# Altium project Grabber.PrjPCB (part 1 of 2)
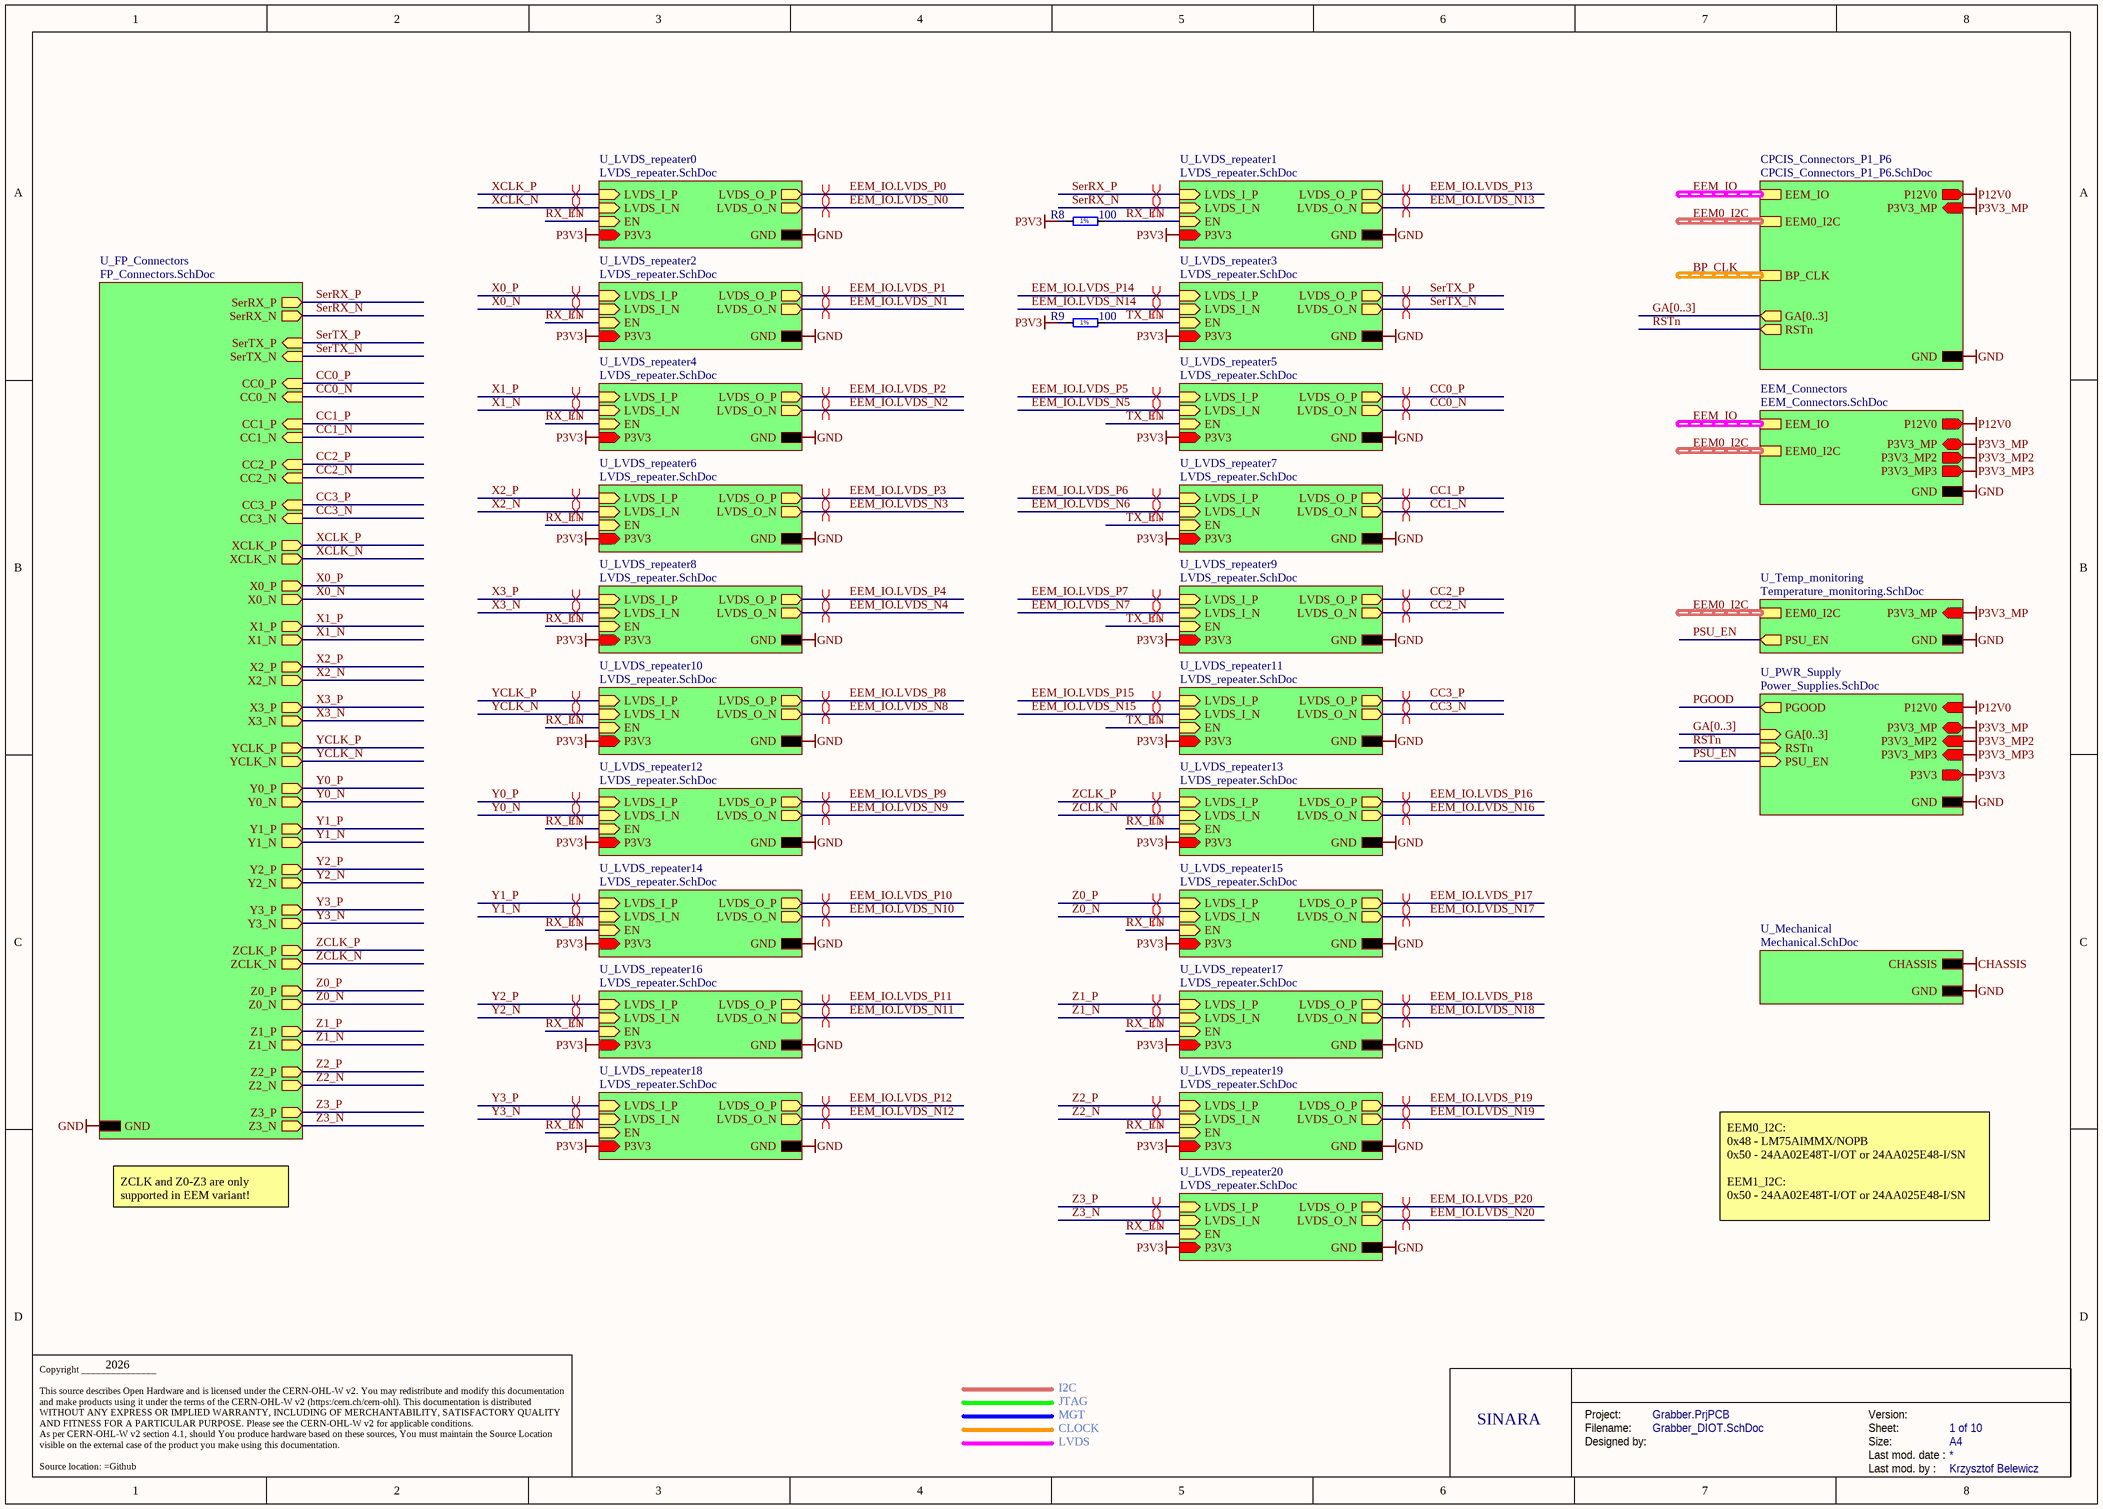
[diagram p0: Grabber_DIOT.SchDoc]
P_version: 2.0.0; P_github_link: https://github.com/sinara-hw/Grabber; P_author3: Krzysztof Belewicz; P_author2: Maciej Przybysz, Marta Fąfara; P_author1: Grzegorz Kasprowicz
9 sheets, 220 parts. Net scope: strictly hierarchical (ports join the sheet entries above them; power ports are local).
Board file: Grabber_DIOT.PCBDOC
Sheets:
  Grabber_DIOT.SchDoc
    U_PWR_Supply = Power_Supplies.SchDoc
    CPCIS_Connectors_P1_P6 = CPCIS_Connectors_P1_P6.SchDoc
      U_DIOT_signal_routing = DIOT_signal_routing.SchDoc
    EEM_Connectors = EEM_Connectors.SchDoc
    U_Temp_monitoring = Temperature_monitoring.SchDoc
    U_Mechanical = Mechanical.SchDoc
    U_FP_Connectors = FP_Connectors.SchDoc
    U_LVDS_repeater0 = LVDS_repeater.SchDoc
    U_LVDS_repeater2 = LVDS_repeater.SchDoc
    U_LVDS_repeater4 = LVDS_repeater.SchDoc
    U_LVDS_repeater6 = LVDS_repeater.SchDoc
    U_LVDS_repeater8 = LVDS_repeater.SchDoc
    U_LVDS_repeater10 = LVDS_repeater.SchDoc
    U_LVDS_repeater12 = LVDS_repeater.SchDoc
    U_LVDS_repeater14 = LVDS_repeater.SchDoc
    U_LVDS_repeater16 = LVDS_repeater.SchDoc
    U_LVDS_repeater18 = LVDS_repeater.SchDoc
    U_LVDS_repeater1 = LVDS_repeater.SchDoc
    U_LVDS_repeater3 = LVDS_repeater.SchDoc
    U_LVDS_repeater5 = LVDS_repeater.SchDoc
    U_LVDS_repeater7 = LVDS_repeater.SchDoc
    U_LVDS_repeater9 = LVDS_repeater.SchDoc
    U_LVDS_repeater11 = LVDS_repeater.SchDoc
    U_LVDS_repeater13 = LVDS_repeater.SchDoc
    U_LVDS_repeater15 = LVDS_repeater.SchDoc
    U_LVDS_repeater17 = LVDS_repeater.SchDoc
    U_LVDS_repeater19 = LVDS_repeater.SchDoc
    U_LVDS_repeater20 = LVDS_repeater.SchDoc

## Sheet Grabber_DIOT.SchDoc: =DocumentName
size A3; DocumentNumber: 1; Revision: 0; SheetNumber: 1; SheetTotal: 10; Version: 2.0.0; Author 1: Grzegorz Kasprowicz; Author 2: Maciej Przybysz, Marta Fąfara; Author 3: Krzysztof Belewicz; Github: https://github.com/sinara-hw/Grabber; Last modified by: Krzysztof Belewicz

### Parts
R8  100  [RESC1005X40N]
R9  100  [RESC1005X40N]

### Sub-sheets
CPCIS_Connectors_P1_P6 = CPCIS_Connectors_P1_P6.SchDoc: P12V0 (out), P3V3_MP (in), EEM_IO (harness EEM_LVDS), EEM0_I2C (harness I2C), BP_CLK (harness CLK_DIFF), GA[0..3] (out), GND, RSTn (out)
EEM_Connectors = EEM_Connectors.SchDoc: P3V3_MP (bidir), P12V0 (out), EEM_IO (harness EEM_LVDS), EEM0_I2C (harness I2C), GND, P3V3_MP2 (out), P3V3_MP3 (out)
U_FP_Connectors = FP_Connectors.SchDoc: SerRX_P (out), SerRX_N (out), Z3_P (out), Z3_N (out), Z2_P (out), Z2_N (out), Z1_P (out), Z1_N (out), Z0_P (out), Z0_N (out), ZCLK_P (out), ZCLK_N (out), Y3_P (out), Y3_N (out), Y2_P (out), Y2_N (out), Y1_P (out), Y1_N (out), Y0_P (out), Y0_N (out), YCLK_P (out), YCLK_N (out), X3_P (out), X3_N (out), X2_P (out), X2_N (out), X1_P (out), X1_N (out), X0_P (out), X0_N (out), XCLK_P (out), XCLK_N (out), CC3_P (in), CC3_N (in), CC2_P (in), CC2_N (in), CC1_P (in), CC1_N (in), CC0_P (in), CC0_N (in), SerTX_P (in), SerTX_N (in), GND
U_LVDS_repeater0 = LVDS_repeater.SchDoc: LVDS_I_P (in), LVDS_I_N (in), LVDS_O_P (out), LVDS_O_N (out), EN (in), GND, P3V3 (in)
U_LVDS_repeater1 = LVDS_repeater.SchDoc: LVDS_I_P (in), LVDS_I_N (in), LVDS_O_P (out), LVDS_O_N (out), EN (in), GND, P3V3 (in)
U_LVDS_repeater2 = LVDS_repeater.SchDoc: LVDS_I_P (in), LVDS_I_N (in), LVDS_O_P (out), LVDS_O_N (out), EN (in), GND, P3V3 (in)
U_LVDS_repeater3 = LVDS_repeater.SchDoc: LVDS_I_P (in), LVDS_I_N (in), LVDS_O_P (out), LVDS_O_N (out), EN (in), GND, P3V3 (in)
U_LVDS_repeater4 = LVDS_repeater.SchDoc: LVDS_I_P (in), LVDS_I_N (in), LVDS_O_P (out), LVDS_O_N (out), EN (in), GND, P3V3 (in)
U_LVDS_repeater5 = LVDS_repeater.SchDoc: LVDS_I_P (in), LVDS_I_N (in), LVDS_O_P (out), LVDS_O_N (out), EN (in), GND, P3V3 (in)
U_LVDS_repeater6 = LVDS_repeater.SchDoc: LVDS_I_P (in), LVDS_I_N (in), LVDS_O_P (out), LVDS_O_N (out), EN (in), GND, P3V3 (in)
U_LVDS_repeater7 = LVDS_repeater.SchDoc: LVDS_I_P (in), LVDS_I_N (in), LVDS_O_P (out), LVDS_O_N (out), EN (in), GND, P3V3 (in)
U_LVDS_repeater8 = LVDS_repeater.SchDoc: LVDS_I_P (in), LVDS_I_N (in), LVDS_O_P (out), LVDS_O_N (out), EN (in), GND, P3V3 (in)
U_LVDS_repeater9 = LVDS_repeater.SchDoc: LVDS_I_P (in), LVDS_I_N (in), LVDS_O_P (out), LVDS_O_N (out), EN (in), GND, P3V3 (in)
U_LVDS_repeater10 = LVDS_repeater.SchDoc: LVDS_I_P (in), LVDS_I_N (in), LVDS_O_P (out), LVDS_O_N (out), EN (in), GND, P3V3 (in)
U_LVDS_repeater11 = LVDS_repeater.SchDoc: LVDS_I_P (in), LVDS_I_N (in), LVDS_O_P (out), LVDS_O_N (out), EN (in), GND, P3V3 (in)
U_LVDS_repeater12 = LVDS_repeater.SchDoc: LVDS_I_P (in), LVDS_I_N (in), LVDS_O_P (out), LVDS_O_N (out), EN (in), GND, P3V3 (in)
U_LVDS_repeater13 = LVDS_repeater.SchDoc: LVDS_I_P (in), LVDS_I_N (in), LVDS_O_P (out), LVDS_O_N (out), EN (in), GND, P3V3 (in)
U_LVDS_repeater14 = LVDS_repeater.SchDoc: LVDS_I_P (in), LVDS_I_N (in), LVDS_O_P (out), LVDS_O_N (out), EN (in), GND, P3V3 (in)
U_LVDS_repeater15 = LVDS_repeater.SchDoc: LVDS_I_P (in), LVDS_I_N (in), LVDS_O_P (out), LVDS_O_N (out), EN (in), GND, P3V3 (in)
U_LVDS_repeater16 = LVDS_repeater.SchDoc: LVDS_I_P (in), LVDS_I_N (in), LVDS_O_P (out), LVDS_O_N (out), EN (in), GND, P3V3 (in)
U_LVDS_repeater17 = LVDS_repeater.SchDoc: LVDS_I_P (in), LVDS_I_N (in), LVDS_O_P (out), LVDS_O_N (out), EN (in), GND, P3V3 (in)
U_LVDS_repeater18 = LVDS_repeater.SchDoc: LVDS_I_P (in), LVDS_I_N (in), LVDS_O_P (out), LVDS_O_N (out), EN (in), GND, P3V3 (in)
U_LVDS_repeater19 = LVDS_repeater.SchDoc: LVDS_I_P (in), LVDS_I_N (in), LVDS_O_P (out), LVDS_O_N (out), EN (in), GND, P3V3 (in)
U_LVDS_repeater20 = LVDS_repeater.SchDoc: LVDS_I_P (in), LVDS_I_N (in), LVDS_O_P (out), LVDS_O_N (out), EN (in), GND, P3V3 (in)
U_Mechanical = Mechanical.SchDoc: CHASSIS, GND
U_PWR_Supply = Power_Supplies.SchDoc: GND, P12V0 (in), P3V3 (out), P3V3_MP (bidir), PGOOD (out), GA[0..3] (in), RSTn (in), PSU_EN (in), P3V3_MP2 (in), P3V3_MP3 (in)
U_Temp_monitoring = Temperature_monitoring.SchDoc: GND, P3V3_MP (in), EEM0_I2C (harness I2C), PSU_EN (out)

### Nets
GND: sheet U_PWR_Supply/GND, sheet CPCIS_Connectors_P1_P6/GND, sheet EEM_Connectors/GND, sheet U_Temp_monitoring/GND, sheet U_Mechanical/GND, sheet U_FP_Connectors/GND, sheet U_LVDS_repeater0/GND, sheet U_LVDS_repeater2/GND, sheet U_LVDS_repeater4/GND, sheet U_LVDS_repeater6/GND, sheet U_LVDS_repeater8/GND, sheet U_LVDS_repeater10/GND, sheet U_LVDS_repeater12/GND, sheet U_LVDS_repeater14/GND, sheet U_LVDS_repeater16/GND, sheet U_LVDS_repeater18/GND, sheet U_LVDS_repeater1/GND, sheet U_LVDS_repeater3/GND, sheet U_LVDS_repeater5/GND, sheet U_LVDS_repeater7/GND, sheet U_LVDS_repeater9/GND, sheet U_LVDS_repeater11/GND, sheet U_LVDS_repeater13/GND, sheet U_LVDS_repeater15/GND, sheet U_LVDS_repeater17/GND, sheet U_LVDS_repeater19/GND, sheet U_LVDS_repeater20/GND
P3V3: R8.1 R9.1 ; sheet U_PWR_Supply/P3V3, sheet U_LVDS_repeater0/P3V3, sheet U_LVDS_repeater2/P3V3, sheet U_LVDS_repeater4/P3V3, sheet U_LVDS_repeater6/P3V3, sheet U_LVDS_repeater8/P3V3, sheet U_LVDS_repeater10/P3V3, sheet U_LVDS_repeater12/P3V3, sheet U_LVDS_repeater14/P3V3, sheet U_LVDS_repeater16/P3V3, sheet U_LVDS_repeater18/P3V3, sheet U_LVDS_repeater1/P3V3, sheet U_LVDS_repeater3/P3V3, sheet U_LVDS_repeater5/P3V3, sheet U_LVDS_repeater7/P3V3, sheet U_LVDS_repeater9/P3V3, sheet U_LVDS_repeater11/P3V3, sheet U_LVDS_repeater13/P3V3, sheet U_LVDS_repeater15/P3V3, sheet U_LVDS_repeater17/P3V3, sheet U_LVDS_repeater19/P3V3, sheet U_LVDS_repeater20/P3V3
P3V3_MP: sheet U_PWR_Supply/P3V3_MP, sheet CPCIS_Connectors_P1_P6/P3V3_MP, sheet EEM_Connectors/P3V3_MP, sheet U_Temp_monitoring/P3V3_MP
P3V3_MP2: sheet U_PWR_Supply/P3V3_MP2, sheet EEM_Connectors/P3V3_MP2
P3V3_MP3: sheet U_PWR_Supply/P3V3_MP3, sheet EEM_Connectors/P3V3_MP3
P12V0: sheet U_PWR_Supply/P12V0, sheet CPCIS_Connectors_P1_P6/P12V0, sheet EEM_Connectors/P12V0
CC0_N: sheet U_FP_Connectors/CC0_N, sheet U_LVDS_repeater5/LVDS_O_N
CC0_P: sheet U_FP_Connectors/CC0_P, sheet U_LVDS_repeater5/LVDS_O_P
CC1_N: sheet U_FP_Connectors/CC1_N, sheet U_LVDS_repeater7/LVDS_O_N
CC1_P: sheet U_FP_Connectors/CC1_P, sheet U_LVDS_repeater7/LVDS_O_P
CC2_N: sheet U_FP_Connectors/CC2_N, sheet U_LVDS_repeater9/LVDS_O_N
CC2_P: sheet U_FP_Connectors/CC2_P, sheet U_LVDS_repeater9/LVDS_O_P
CC3_N: sheet U_FP_Connectors/CC3_N, sheet U_LVDS_repeater11/LVDS_O_N
CC3_P: sheet U_FP_Connectors/CC3_P, sheet U_LVDS_repeater11/LVDS_O_P
PSU_EN: sheet U_PWR_Supply/PSU_EN, sheet U_Temp_monitoring/PSU_EN
RSTn: sheet U_PWR_Supply/RSTn, sheet CPCIS_Connectors_P1_P6/RSTn
RX_EN: R8.2 ; sheet U_LVDS_repeater0/EN, sheet U_LVDS_repeater2/EN, sheet U_LVDS_repeater4/EN, sheet U_LVDS_repeater6/EN, sheet U_LVDS_repeater8/EN, sheet U_LVDS_repeater10/EN, sheet U_LVDS_repeater12/EN, sheet U_LVDS_repeater14/EN, sheet U_LVDS_repeater16/EN, sheet U_LVDS_repeater18/EN, sheet U_LVDS_repeater1/EN, sheet U_LVDS_repeater13/EN, sheet U_LVDS_repeater15/EN, sheet U_LVDS_repeater17/EN, sheet U_LVDS_repeater19/EN, sheet U_LVDS_repeater20/EN
SerRX_N: sheet U_FP_Connectors/SerRX_N, sheet U_LVDS_repeater1/LVDS_I_N
SerRX_P: sheet U_FP_Connectors/SerRX_P, sheet U_LVDS_repeater1/LVDS_I_P
SerTX_N: sheet U_FP_Connectors/SerTX_N, sheet U_LVDS_repeater3/LVDS_O_N
SerTX_P: sheet U_FP_Connectors/SerTX_P, sheet U_LVDS_repeater3/LVDS_O_P
TX_EN: R9.2 ; sheet U_LVDS_repeater3/EN, sheet U_LVDS_repeater5/EN, sheet U_LVDS_repeater7/EN, sheet U_LVDS_repeater9/EN, sheet U_LVDS_repeater11/EN
X0_N: sheet U_FP_Connectors/X0_N, sheet U_LVDS_repeater2/LVDS_I_N
X0_P: sheet U_FP_Connectors/X0_P, sheet U_LVDS_repeater2/LVDS_I_P
X1_N: sheet U_FP_Connectors/X1_N, sheet U_LVDS_repeater4/LVDS_I_N
X1_P: sheet U_FP_Connectors/X1_P, sheet U_LVDS_repeater4/LVDS_I_P
X2_N: sheet U_FP_Connectors/X2_N, sheet U_LVDS_repeater6/LVDS_I_N
X2_P: sheet U_FP_Connectors/X2_P, sheet U_LVDS_repeater6/LVDS_I_P
X3_N: sheet U_FP_Connectors/X3_N, sheet U_LVDS_repeater8/LVDS_I_N
X3_P: sheet U_FP_Connectors/X3_P, sheet U_LVDS_repeater8/LVDS_I_P
XCLK_N: sheet U_FP_Connectors/XCLK_N, sheet U_LVDS_repeater0/LVDS_I_N
XCLK_P: sheet U_FP_Connectors/XCLK_P, sheet U_LVDS_repeater0/LVDS_I_P
Y0_N: sheet U_FP_Connectors/Y0_N, sheet U_LVDS_repeater12/LVDS_I_N
Y0_P: sheet U_FP_Connectors/Y0_P, sheet U_LVDS_repeater12/LVDS_I_P
Y1_N: sheet U_FP_Connectors/Y1_N, sheet U_LVDS_repeater14/LVDS_I_N
Y1_P: sheet U_FP_Connectors/Y1_P, sheet U_LVDS_repeater14/LVDS_I_P
Y2_N: sheet U_FP_Connectors/Y2_N, sheet U_LVDS_repeater16/LVDS_I_N
Y2_P: sheet U_FP_Connectors/Y2_P, sheet U_LVDS_repeater16/LVDS_I_P
Y3_N: sheet U_FP_Connectors/Y3_N, sheet U_LVDS_repeater18/LVDS_I_N
Y3_P: sheet U_FP_Connectors/Y3_P, sheet U_LVDS_repeater18/LVDS_I_P
YCLK_N: sheet U_FP_Connectors/YCLK_N, sheet U_LVDS_repeater10/LVDS_I_N
YCLK_P: sheet U_FP_Connectors/YCLK_P, sheet U_LVDS_repeater10/LVDS_I_P
Z0_N: sheet U_FP_Connectors/Z0_N, sheet U_LVDS_repeater15/LVDS_I_N
Z0_P: sheet U_FP_Connectors/Z0_P, sheet U_LVDS_repeater15/LVDS_I_P
Z1_N: sheet U_FP_Connectors/Z1_N, sheet U_LVDS_repeater17/LVDS_I_N
Z1_P: sheet U_FP_Connectors/Z1_P, sheet U_LVDS_repeater17/LVDS_I_P
Z2_N: sheet U_FP_Connectors/Z2_N, sheet U_LVDS_repeater19/LVDS_I_N
Z2_P: sheet U_FP_Connectors/Z2_P, sheet U_LVDS_repeater19/LVDS_I_P
Z3_N: sheet U_FP_Connectors/Z3_N, sheet U_LVDS_repeater20/LVDS_I_N
Z3_P: sheet U_FP_Connectors/Z3_P, sheet U_LVDS_repeater20/LVDS_I_P
ZCLK_N: sheet U_FP_Connectors/ZCLK_N, sheet U_LVDS_repeater13/LVDS_I_N
ZCLK_P: sheet U_FP_Connectors/ZCLK_P, sheet U_LVDS_repeater13/LVDS_I_P

### Buses and harness runs
bus GA[0..3] = sheet CPCIS_Connectors_P1_P6/GA[0..3]
bus GA[0..3] = sheet U_PWR_Supply/GA[0..3]
harness BP_CLK = sheet CPCIS_Connectors_P1_P6/BP_CLK
harness EEM0_I2C = sheet CPCIS_Connectors_P1_P6/EEM0_I2C
harness EEM0_I2C = sheet EEM_Connectors/EEM0_I2C
harness EEM0_I2C = sheet U_Temp_monitoring/EEM0_I2C
harness EEM_IO = sheet CPCIS_Connectors_P1_P6/EEM_IO
harness EEM_IO = sheet EEM_Connectors/EEM_IO

### Layout directives
differential pair: CC0_N, CC0_P, CC1_N, CC1_P, CC2_N, CC2_P, CC3_N, CC3_P, EEM_IO.LVDS_N0, EEM_IO.LVDS_N1, EEM_IO.LVDS_N2, EEM_IO.LVDS_N3, EEM_IO.LVDS_N4, EEM_IO.LVDS_N5, EEM_IO.LVDS_N6, EEM_IO.LVDS_N7, EEM_IO.LVDS_N8, EEM_IO.LVDS_N9, EEM_IO.LVDS_N10, EEM_IO.LVDS_N11, EEM_IO.LVDS_N12, EEM_IO.LVDS_N13, EEM_IO.LVDS_N14, EEM_IO.LVDS_N15, EEM_IO.LVDS_N16, EEM_IO.LVDS_N17, EEM_IO.LVDS_N18, EEM_IO.LVDS_N19, EEM_IO.LVDS_N20, EEM_IO.LVDS_P0, EEM_IO.LVDS_P1, EEM_IO.LVDS_P2, EEM_IO.LVDS_P3, EEM_IO.LVDS_P4, EEM_IO.LVDS_P5, EEM_IO.LVDS_P6, EEM_IO.LVDS_P7, EEM_IO.LVDS_P8, EEM_IO.LVDS_P9, EEM_IO.LVDS_P10, EEM_IO.LVDS_P11, EEM_IO.LVDS_P12, EEM_IO.LVDS_P13, EEM_IO.LVDS_P14, EEM_IO.LVDS_P15, EEM_IO.LVDS_P16, EEM_IO.LVDS_P17, EEM_IO.LVDS_P18, EEM_IO.LVDS_P19, EEM_IO.LVDS_P20, SerRX_N, SerRX_P, SerTX_N, SerTX_P, X0_N, X0_P, X1_N, X1_P, X2_N, X2_P, X3_N, X3_P, XCLK_N, XCLK_P, Y0_N, Y0_P, Y1_N, Y1_P, Y2_N, Y2_P, Y3_N, Y3_P, YCLK_N, YCLK_P, Z0_N, Z0_P, Z1_N, Z1_P, Z2_N, Z2_P, Z3_N, Z3_P, ZCLK_N, ZCLK_P

### Notes on the sheet
- ZCLK and Z0-Z3 are only supported in EEM variant!
- EEM0_I2C:
  0x48 - LM75AIMMX/NOPB
  0x50 - 24AA02E48T-I/OT or 24AA025E48-I/SN
  EEM1_I2C:
  0x50 - 24AA02E48T-I/OT or 24AA025E48-I/SN
- 2026
- I2C
- JTAG
- MGT
- CLOCK
- LVDS
- SINARA
- Project:
- Designed by:
- Filename:
- Size:
- Version:
- Last mod. date :
- Sheet:
- A4
- Copyright _______________
  This source describes Open Hardware and is licensed under the CERN-OHL-W v2. You may redistribute and modify this documentation and make products using it under the terms of the CERN-OHL-W v2 (https:/cern.ch/cern-ohl). This documentation is distributed WITHOUT ANY EXPRESS OR IMPLIED WARRANTY, INCLUDING OF MERCHANTABILITY, SATISFACTORY QUALITY AND FITNESS FOR A PARTICULAR PURPOSE. Please see the CERN-OHL-W v2 for applicable conditions.
  As per CERN-OHL-W v2 section 4.1, should You produce hardware based on these sources, You must maintain the Source Location visible on the external case of the product you make using this documentation.
  Source location: =Github
- Last mod. by :
- (in symbol R0402_100R_1%_0.1W_100PPM) 1%

### Library data of the parts
R8 R9 = R0402_100R_1%_0.1W_100PPM: Resistor - 1%; Part Description: General Purpose Thick Film Chip Resistor; Manufacturer: GENERIC; Manufacturer Part Number: R0402_100R_1%_0.1W_100PPM_50V; Manufacturer1 Part Number: ERJ2RKF1000X; Power: 0.1W; TC: ±100ppm/°C; Voltage: 50V; Part Number: R0402_100R_1%_0.1W_100PPM; Component Kind: Standard; Component Type: Standard; Pin Count: 2; Value: 100; Status: Not recommended; Tolerance: ±1%; Case: 0402; Mounted: Yes; Sense: No; Socket: No; SMD: Yes; Manufacturer1 Example: PANASONIC; Manufacturer1 ComponentHeight: 0.4mm; HelpURL: \\cern.ch\dfs\Applications\Altium\Datasheets\R0402_PANASONIC_ERJ2RK.pdf; Author: CERN DEM JLC; CreateDate: 12.12.2013; LatestRevisionDate: 03.03.2015

## Sheet Power_Supplies.SchDoc: =DocumentName
size A4; DocumentNumber: 1; Revision: 0; SheetNumber: 3; SheetTotal: 10; Version: 2.0.0; Author 1: Grzegorz Kasprowicz; Author 2: Maciej Przybysz, Marta Fąfara; Author 3: Krzysztof Belewicz; Github: https://github.com/sinara-hw/Grabber; Last modified by: Krzysztof Belewicz
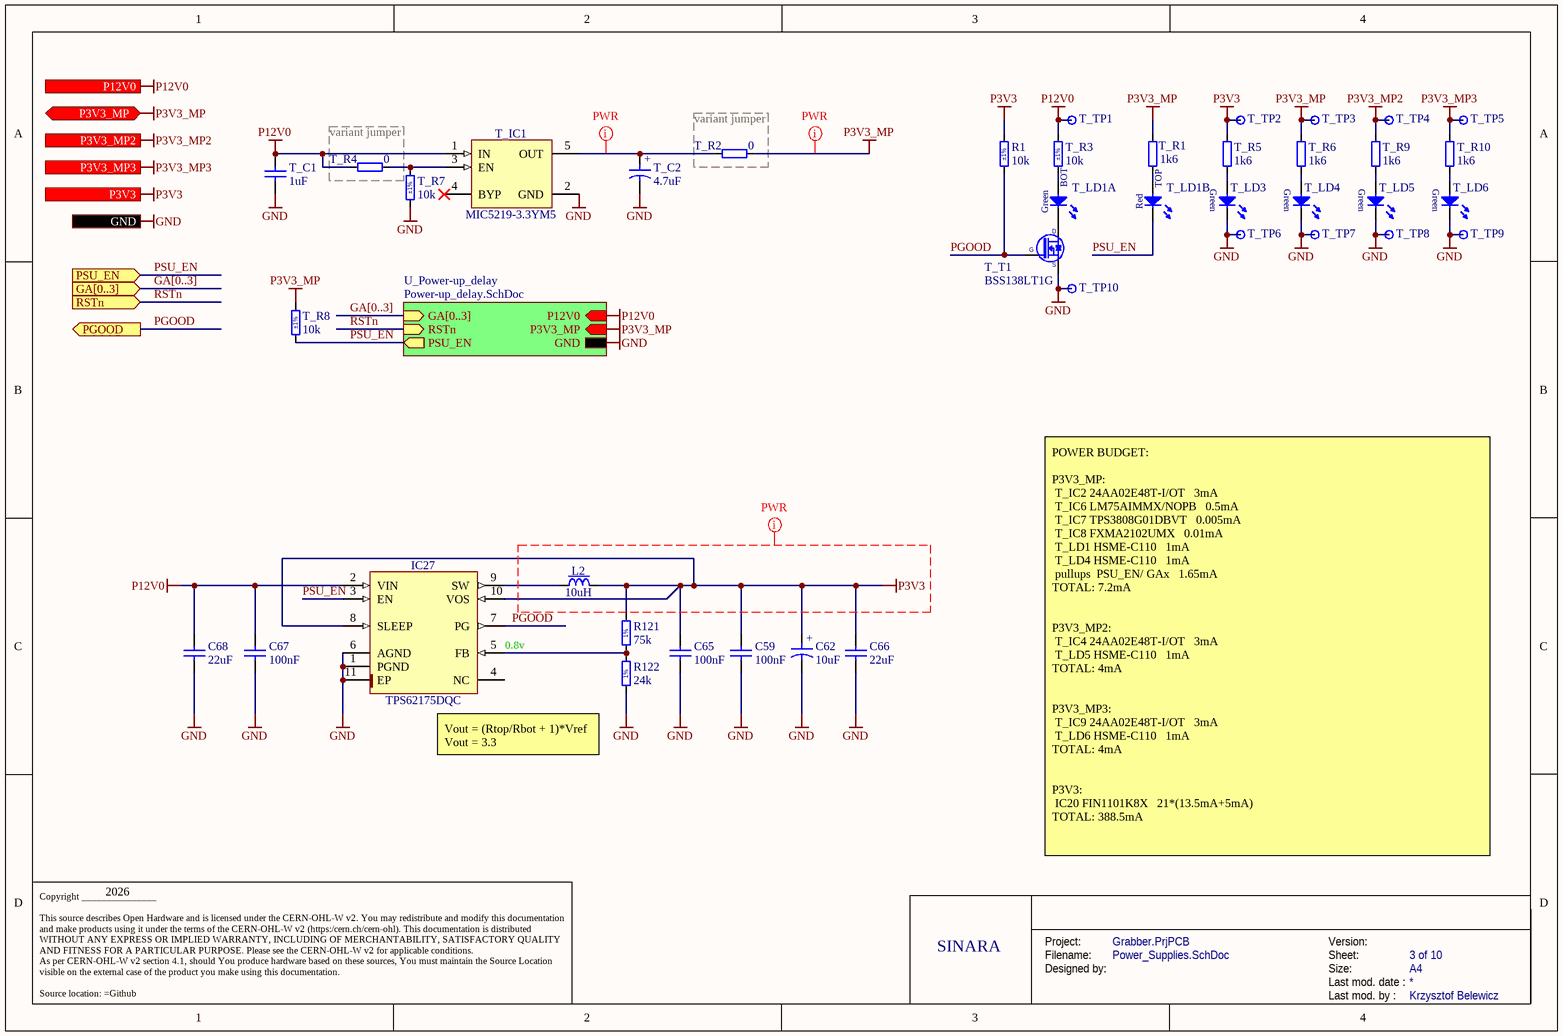
[diagram p1: Power_Supplies.SchDoc]

### Parts
C59  100nF  [CAPC1005X55N]
C62  10uF  [CAPAE430X540N]
C65  100nF  [CAPC1005X55N]
C66  22uF  [CAPC2012X135N]
C67  100nF  [CAPC1005X55N]
C68  22uF  [CAPC2012X135N]
IC27  TPS62175DQC  [SON50P200X300X80-11N-R94X250]
L2  10uH  [IND_MURATA-PS_8400]
R1  10k  Tolerance: ±1%  [RESC1005X40N]
R121  75k  [RESC1005X40N]
R122  24k  [RESC1005X40N]
T_C1  1uF  [CAPC1608X87N]
T_C2  4.7uF  [CAPMP3216X180N]
T_IC1  MIC5219-3.3YM5  [SOT95P280X145-5N]
T_LD1  Red/Green  [LED_DIALIGHT_571-0112F]  (value not drawn)  (parts A,B of 2)
T_LD3  Green  [LED_KINGBRIGHT_KPH-1608CGCK]  (value not drawn)
T_LD4  Green  [LED_KINGBRIGHT_KPH-1608CGCK]  (value not drawn)
T_LD5  Green  [LED_KINGBRIGHT_KPH-1608CGCK]  (value not drawn)
T_LD6  Green  [LED_KINGBRIGHT_KPH-1608CGCK]  (value not drawn)
T_R1  1k6  [RESC1005X40N]
T_R2  0  [RESC1005X40N]
T_R3  10k  Tolerance: ±1%  [RESC1005X40N]
T_R4  0  [RESC1005X40N]
T_R5  1k6  [RESC1005X40N]
T_R6  1k6  [RESC1005X40N]
T_R7  10k  Tolerance: ±1%  [RESC1005X40N]
T_R8  10k  Tolerance: ±1%  [RESC1005X40N]
T_R9  1k6  [RESC1005X40N]
T_R10  1k6  [RESC1005X40N]
T_T1  BSS138LT1G  [SOT95P240X110-3N]
T_TP1  Test Point  [TPS127]  (value not drawn)  (no BOM)
T_TP2  Test Point  [TPS127]  (value not drawn)  (no BOM)
T_TP3  Test Point  [TPS127]  (value not drawn)  (no BOM)
T_TP4  Test Point  [TPS127]  (value not drawn)  (no BOM)
T_TP5  Test Point  [TPS127]  (value not drawn)  (no BOM)
T_TP6  Test Point  [TPS127]  (value not drawn)  (no BOM)
T_TP7  Test Point  [TPS127]  (value not drawn)  (no BOM)
T_TP8  Test Point  [TPS127]  (value not drawn)  (no BOM)
T_TP9  Test Point  [TPS127]  (value not drawn)  (no BOM)
T_TP10  Test Point  [TPS127]  (value not drawn)  (no BOM)

### Blocks framed on the sheet
variant jumper: T_R4
variant jumper: T_R2

### Sub-sheets
U_Power-up_delay = Power-up_delay.SchDoc (file not in this document): GA[0..3] (in), RSTn (in), GND, PSU_EN (out), P3V3_MP (in), P12V0 (in)

### Ports
GA[0..3] (in), GND, P3V3 (out), P3V3_MP2 (in), P3V3_MP3 (in), P3V3_MP (bidir), P12V0 (in), PGOOD (out), PSU_EN (in), RSTn (in)

### Nets
GND: C59.1 C62.2 C65.1 C66.1 C67.1 C68.1 IC27.1(PGND) IC27.6(AGND) IC27.11(EP) R122.1 T_C1.1 T_C2.2 T_IC1.2(GND) T_LD3.1(C) T_LD4.1(C) T_LD5.1(C) T_LD6.1(C) T_R7.1 T_T1.2(S) T_TP6.1 T_TP7.1 T_TP8.1 T_TP9.1 T_TP10.1 ; port GND, sheet U_Power-up_delay/GND
P3V3: C59.2 C62.1 C65.2 C66.2 IC27.8(SLEEP) IC27.10(VOS) L2.2 R1.2 R121.2 T_R5.2 T_TP2.1 ; port P3V3
P3V3_MP: T_R1.2 T_R2.2 T_R6.2 T_R8.2 T_TP3.1 ; port P3V3_MP, sheet U_Power-up_delay/P3V3_MP
P3V3_MP2: T_R9.2 T_TP4.1 ; port P3V3_MP2
P3V3_MP3: T_R10.2 T_TP5.1 ; port P3V3_MP3
P12V0: C67.2 C68.2 IC27.2(VIN) T_C1.2 T_IC1.1(IN) T_R3.2 T_R4.1 T_TP1.1 ; port P12V0, sheet U_Power-up_delay/P12V0
PGOOD: IC27.7(PG) R1.1 T_T1.1(G) ; port PGOOD
PSU_EN: IC27.3(EN) T_LD1.3(C) T_R8.1 ; port PSU_EN, sheet U_Power-up_delay/PSU_EN
RSTn: port RSTn, sheet U_Power-up_delay/RSTn
NetIC27_5: IC27.5(FB) R121.1 R122.2
NetIC27_9: IC27.9(SW) L2.1
NetT_C2_1: T_C2.1 T_IC1.5(OUT) T_R2.1
NetT_IC1_3: T_IC1.3(EN) T_R4.2 T_R7.2
NetT_LD1_1: T_LD1.1(C) T_T1.3(D)
NetT_LD1_2: T_LD1.2(A) T_R3.1
NetT_LD1_4: T_LD1.4(A) T_R1.1
NetT_LD3_2: T_LD3.2(A) T_R5.1
NetT_LD4_2: T_LD4.2(A) T_R6.1
NetT_LD5_2: T_LD5.2(A) T_R9.1
NetT_LD6_2: T_LD6.2(A) T_R10.1

Not connected (* = marked no-connect by the designer): IC27 4(NC); T_IC1 4(BYP)*

### Buses and harness runs
bus GA[0..3] = port GA[0..3]
bus GA[0..3] = sheet U_Power-up_delay/GA[0..3]

### Layout directives
net class PWR: NetT_C2_1, P3V3, P3V3_MP

### Notes on the sheet
- (near IC27) 0.8v
- Vout = (Rtop/Rbot + 1)*Vref
  Vout = 3.3
- POWER BUDGET:
  P3V3_MP:
  T_IC2	24AA02E48T-I/OT			3mA
  T_IC6	LM75AIMMX/NOPB			0.5mA
  T_IC7	TPS3808G01DBVT			0.005mA
  T_IC8	FXMA2102UMX			0.01mA
  T_LD1	HSME-C110			1mA
  T_LD4	HSME-C110			1mA
  pullups 	PSU_EN/ GAx			1.65mA
  TOTAL: 7.2mA
  P3V3_MP2:
  T_IC4	24AA02E48T-I/OT			3mA
  T_LD5	HSME-C110			1mA
  TOTAL: 4mA
  P3V3_MP3:
  T_IC9	24AA02E48T-I/OT			3mA
  T_LD6	HSME-C110			1mA
  TOTAL: 4mA
  P3V3:
  IC20	FIN1101K8X			21*(13.5mA+5mA)
  TOTAL: 388.5mA
- 2026
- SINARA
- Project:
- Designed by:
- Filename:
- Size:
- Version:
- Last mod. date :
- Sheet:
- A4
- Copyright _______________
  This source describes Open Hardware and is licensed under the CERN-OHL-W v2. You may redistribute and modify this documentation and make products using it under the terms of the CERN-OHL-W v2 (https:/cern.ch/cern-ohl). This documentation is distributed WITHOUT ANY EXPRESS OR IMPLIED WARRANTY, INCLUDING OF MERCHANTABILITY, SATISFACTORY QUALITY AND FITNESS FOR A PARTICULAR PURPOSE. Please see the CERN-OHL-W v2 for applicable conditions.
  As per CERN-OHL-W v2 section 4.1, should You produce hardware based on these sources, You must maintain the Source Location visible on the external case of the product you make using this documentation.
  Source location: =Github
- Last mod. by :
- (in symbol CAE430-540_10UF_16V_20%) +
- (in symbol CTE3216-18_4.7UF_10V_10%_AVX_TPSA475K010T1400) +
- (in symbol LED_DIALIGHT_571-0112F, part A) BOT; Green
- (in symbol LED_DIALIGHT_571-0112F, part B) TOP; Red
- (in symbol R0402_24K_1%_0.0625W_100PPM) 1%
- (in symbol R0402_75K_1%_0.0625W_100PPM) 1%

### Library data of the parts
C59 C65 C67 = CC0402_100NF_50V_10%_X7R: Non-polarised capacitor; Part Description: SMD Multilayer Chip Ceramic Capacitor; Manufacturer: GENERIC; Manufacturer1 Part Number: GRM155R71H104KE14D; Voltage: 50V; TC: X7R; Tolerance: ±10%; Part Number: CC0402_100NF_50V_10%_X7R; Component Kind: Standard; Component Type: Standard; Pin Count: 2; Value: 100nF; Status: None; Manufacturer Part Number: CC0402_100NF_50V_10%_X7R; Case: 0402; Mounted: Yes; Socket: No; SMD: Yes; Sense: No; HelpURL: \\cern.ch\dfs\Applications\Altium\Datasheets\CC0402_MURATA_GRM155R71H104KE14D.pdf; Author: CERN DEM MR; CreateDate: 30.06.2017; LatestRevisionDate: 30.06.2017; Manufacturer1 Example: MURATA; Manufacturer1 ComponentHeight: 0.55mm
C62 = CAE430-540_10UF_16V_20%: Polarised capacitor; Part Description: Aluminum Electrolytic SMT Capacitor; Manufacturer: PANASONIC; Manufacturer Part Number: EEEFK1C100AR; Voltage: 16V; Tolerance: ±20%; Part Number: CAE430-540_10UF_16V_20%; Component Kind: Standard; Component Type: Standard; Pin Count: 2; Value: 10uF; Status: Not Recommended; Case: B; Mounted: Yes; Socket: No; SMD: Yes; Sense: No; ComponentHeight: 5.8mm; HelpURL: \\cern.ch\dfs\Applications\Altium\Datasheets\CAE_PANASONIC_FK.pdf; Author: CERN DEM JLC; CreateDate: 03.12.2007; LatestRevisionDate: 05.11.2014
C66 C68 = CC0805_22UF_16V_10%_X5R: Non-polarised capacitor; Part Description: SMD Multilayer Chip Ceramic Capacitor; Manufacturer: GENERIC; Manufacturer1 Part Number: C2012X5R1C226KT; Voltage: 16V; TC: X5R; Tolerance: ±10%; Part Number: CC0805_22UF_16V_10%_X5R; Component Kind: Standard; Component Type: Standard; Pin Count: 2; Value: 22uF; Status: Preferred; Manufacturer Part Number: CC0805_22UF_16V_10%_X5R; Case: 0805; Mounted: Yes; Socket: No; SMD: Yes; Sense: No; Manufacturer1 Example: TDK; Manufacturer1 ComponentHeight: 1.35mm; HelpURL: \\cern.ch\dfs\Applications\Altium\Datasheets\CC0805_X5R_TDK_C.pdf; Author: CERN DEM JLC; CreateDate: 25.10.2012; LatestRevisionDate: 25.10.2012
IC27 = TPS62175DQC: 4.75-28VDC to 1-6VDC, 500mA Step-Down Converter With Sleep Mode; Manufacturer: TEXAS INSTRUMENTS; PressFit: No; Bonding: No; Part Number: TPS62175DQC; Component Kind: Standard; Component Type: Standard; Device: TPS62175DQC; PackageDescription: SON, 10-Leads, Body 2x3mm, Pitch 0.5mm, Thermal Pad 0.94x2.5mm, IPC Medium Density; Part Description: 4.75-28VDC to 1-6VDC, 500mA Step-Down Converter With Sleep Mode; Manufacturer Part Number: TPS62175DQC; Pin Count: 11; Case: SON10; Mounted: Yes; Socket: No; SMD: Yes; Sense: No; ComponentHeight: 0.8mm; HelpURL: \\cern.ch\dfs\Applications\Altium\Datasheets\TPS62175DQC.pdf; Author: CERN DEM JMW; CreateDate: 11.08.2015; LatestRevisionDate: 11.08.2015
L2 = IND_10UH_10%_MURATA-PS_8400: Inductor With Core; Part Description: Miniature Surface Mount Power Inductor (8400 Serie); Manufacturer: MURATA POWER SOLUTIONS; Manufacturer Part Number: 84103C; Power: 950mA; Resistance: 0.24R; Tolerance: ±10%; Part Number: IND_10UH_10%_MURATA-PS_8400; Component Kind: Standard; Component Type: Standard; Pin Count: 2; Value: 10uH; Status: None; Mounted: Yes; Socket: No; SMD: Yes; Sense: No; ComponentHeight: 2.9mm; HelpURL: \\cern.ch\dfs\Applications\Altium\Datasheets\IND_MURATA-PS_8400.pdf; Author: CERN DEM JLC; CreateDate: 02.07.2012; LatestRevisionDate: 02.07.2012
R1 T_R3 T_R7 T_R8 = R0402_10K_1%_0.0625W_100PPM: Resistor - 1%; Part Description: General Purpose Thick Film Chip Resistor; Manufacturer: GENERIC; Manufacturer1 Part Number: 232270671003L; TC: ±100ppm/°C; PressFit: No; Part Number: R0402_10K_1%_0.0625W_100PPM; Component Kind: Standard; Component Type: Standard; Pin Count: 2; Value: 10k; Status: Not Recommended; Power: 0.0625W; Manufacturer Part Number: R0402_10K_1%_0.0625W_100PPM; Case: 0402; Mounted: Yes; Sense: No; Socket: No; SMD: Yes; Manufacturer1 Example: YAGEO PHYCOMP; Manufacturer1 ComponentHeight: 0.4mm; HelpURL: \\cern.ch\dfs\Applications\Altium\Datasheets\R0402_Phycomp_RC0402.pdf; Author: CERN DEM JLC; CreateDate: 03.12.2007; LatestRevisionDate: 17.10.2012
R121 = R0402_75K_1%_0.0625W_100PPM: Resistor - 1%; Part Description: General Purpose Thick Film Chip Resistor; Manufacturer: GENERIC; Manufacturer1 Part Number: 232270677503L; TC: ±100ppm/°C; PressFit: No; Part Number: R0402_75K_1%_0.0625W_100PPM; Component Kind: Standard; Component Type: Standard; Pin Count: 2; Value: 75k; Status: Not Recommended; Power: 0.0625W; Tolerance: ±1%; Manufacturer Part Number: R0402_75K_1%_0.0625W_100PPM; Case: 0402; Mounted: Yes; Sense: No; Socket: No; SMD: Yes; Manufacturer1 Example: YAGEO PHYCOMP; Manufacturer1 ComponentHeight: 0.4mm; HelpURL: \\cern.ch\dfs\Applications\Altium\Datasheets\R0402_Phycomp_RC0402.pdf; Author: CERN DEM JLC; CreateDate: 03/12/2007; LatestRevisionDate: 17/10/2012
R122 = R0402_24K_1%_0.0625W_100PPM: Resistor - 1%; Part Description: General Purpose Thick Film Chip Resistor; Manufacturer: GENERIC; Manufacturer1 Part Number: 232270672403L; TC: ±100ppm/°C; PressFit: No; Part Number: R0402_24K_1%_0.0625W_100PPM; Component Kind: Standard; Component Type: Standard; Pin Count: 2; Value: 24k; Status: Not Recommended; Power: 0.0625W; Tolerance: ±1%; Manufacturer Part Number: R0402_24K_1%_0.0625W_100PPM; Case: 0402; Mounted: Yes; Sense: No; Socket: No; SMD: Yes; Manufacturer1 Example: YAGEO PHYCOMP; Manufacturer1 ComponentHeight: 0.4mm; HelpURL: \\cern.ch\dfs\Applications\Altium\Datasheets\R0402_Phycomp_RC0402.pdf; Author: CERN DEM JLC; CreateDate: 03/12/2007; LatestRevisionDate: 17/10/2012
T_C1 = CC0603_1UF_25V_10%_X7R: Non-polarised capacitor; Part Description: SMD Multilayer Chip Ceramic Capacitor; Manufacturer: GENERIC; Manufacturer1 Part Number: GRM188R71E105KA12D; Voltage: 25V; TC: X7R; Tolerance: ±10%; Part Number: CC0603_1UF_25V_10%_X7R; Component Kind: Standard; Component Type: Standard; Pin Count: 2; Value: 1uF; Status: None; Manufacturer Part Number: CC0603_1UF_25V_10%_X7R; Case: 0603; Mounted: Yes; Socket: No; SMD: Yes; Sense: No; Manufacturer1 Example: MURATA; Manufacturer1 ComponentHeight: 0.9mm; HelpURL: \\cern.ch\dfs\Applications\Altium\Datasheets\CC0603_X7R_MURATA.pdf; Author: CERN DEM JLC; CreateDate: 18.01.2011; LatestRevisionDate: 18.01.2011
T_C2 = CTE3216-18_4.7UF_10V_10%_AVX_TPSA475K010T1400: Polarised capacitor; Part Description: Low ESR 1R4 Automotive Solid Tantalum Chip Capacitor; Manufacturer: AVX; Voltage: 10V; Tolerance: ±10%; Part Number: CTE3216-18_4.7UF_10V_10%_AVX_TPSA475K010T1400; Component Kind: Standard; Component Type: Standard; Pin Count: 2; Value: 4.7uF; Status: Preferred; Manufacturer Part Number: TPSA475K010T1400; Case: A; Mounted: Yes; Socket: No; SMD: Yes; Sense: No; ComponentHeight: 1.8mm; HelpURL: \\cern.ch\dfs\Applications\Altium\Datasheets\CTE-LESR_AVX_TPS-AUTO.pdf; Author: CERN DEM JLC; CreateDate: 23.01.2018; LatestRevisionDate: 23.01.2018
T_IC1 = MIC5219-3.3YM5: 500mA Peak Output LDO Regulator; Part Description: 3.3V 500mA Peak Output Low Drop-Out  (LDO) Regulator; Manufacturer: MICROCHIP TECHNOLOGY; PressFit: No; Bonding: No; Part Number: MIC5219-3.3YM5; Component Kind: Standard; Component Type: Standard; Device: MIC5219-3.3YM5; PackageDescription: SOT, 0.95mm pitch; 5 pin, 1.60mm W X 2.90mm L X 1.45mm H body, IPC Medium Density; Manufacturer Part Number: MIC5219-3.3YM5; Pin Count: 5; Case: SOT23-5; Mounted: Yes; Socket: No; SMD: Yes; Sense: No; ComponentHeight: 1.45mm; HelpURL: \\cern.ch\dfs\Applications\Altium\Datasheets\MIC5219-3.3YM5.pdf; Author: CERN DEM WB; CreateDate: 2019-04-16; LatestRevisionDate: 2019-04-16
T_LD1 = LED_DIALIGHT_571-0112F: 2x LED  Botom Green, Top Red; Part Description: Dual 2mm  LEDs, Red Top,Green Bot, CBI® Circuit Board Indicator (Without positioning pins); PressFit: No; Bonding: No; Part Number: LED_DIALIGHT_571-0112F; Component Kind: Standard; Component Type: Standard; Color: Red/Green; PackageDescription: 2x 2mm LED (Top: Red, Bot: Green) PCB Edge Mounting (Without positioning pins) DIALIGHT 571 Serie; Manufacturer: DIALIGHT; Manufacturer Part Number: 571-0112F; Pin Count: 4; Mounted: Yes; Socket: No; SMD: No; Sense: No; ComponentHeight: 8.6mm; HelpURL: \\cern.ch\dfs\Applications\Altium\Datasheets\LED_DIALIGHT_571-0112F.pdf; Author: CERN DEM JLC; CreateDate: 09.11.2009; LatestRevisionDate: 17.03.2010
T_LD3-T_LD6 = LED_KINGBRIGHT_KPH-1608CGCK: LED Green 1C 2A; Part Description: SMD Green LED, Case 1.6mmX0.8mm(0603), 0.65mm Thickness; PressFit: No; Bonding: No; Part Number: LED_KINGBRIGHT_KPH-1608CGCK; Component Kind: Standard; Component Type: Standard; Color: Green; PackageDescription: SMT Green LED, Case 0603, Body L 1.6 x W 0.8mm H 0.65mm; Manufacturer: KINGBRIGHT; Manufacturer Part Number: KPH-1608CGCK; Pin Count: 2; Mounted: Yes; Socket: No; SMD: Yes; Sense: No; ComponentHeight: 0.65mm; HelpURL: \\cern.ch\dfs\Applications\Altium\Datasheets\LED_KINGBRIGHT_KPH-1608CGCK.pdf; Author: CERN DEM JLC; CreateDate: 03.07.2017; LatestRevisionDate: 03.07.2017
T_R1 T_R5 T_R6 T_R9 T_R10 = R0402_1K6_1%_0.0625W_100PPM: Resistor - 1%; Part Description: General Purpose Thick Film Chip Resistor; Manufacturer: GENERIC; Manufacturer1 Part Number: 232270671602L; TC: ±100ppm/°C; PressFit: No; Part Number: R0402_1K6_1%_0.0625W_100PPM; Component Kind: Standard; Component Type: Standard; Pin Count: 2; Value: 1k6; Status: Not Recommended; Power: 0.0625W; Tolerance: ±1%; Manufacturer Part Number: R0402_1K6_1%_0.0625W_100PPM; Case: 0402; Mounted: Yes; Sense: No; Socket: No; SMD: Yes; Manufacturer1 Example: YAGEO PHYCOMP; Manufacturer1 ComponentHeight: 0.4mm; HelpURL: \\cern.ch\dfs\Applications\Altium\Datasheets\R0402_Phycomp_RC0402.pdf; Author: CERN DEM JLC; CreateDate: 03.12.2007; LatestRevisionDate: 17.10.2012
T_R2 T_R4 = R0402_0R_JUMPER: Resistor; Part Description: 1A (0.05R Max DC Resistance) Zero Ohm Jumper; Manufacturer: GENERIC; Manufacturer1 Part Number: 232270591001L; PressFit: No; Part Number: R0402_0R_JUMPER; Component Kind: Standard; Component Type: Standard; Pin Count: 2; Value: 0; Status: Not Recommended; Manufacturer Part Number: R0402_0R_JUMPER; Case: 0402; Mounted: Yes; Sense: No; Socket: No; SMD: Yes; Manufacturer1 Example: YAGEO PHYCOMP; Manufacturer1 ComponentHeight: 0.4mm; HelpURL: \\cern.ch\dfs\Applications\Altium\Datasheets\R0402_Phycomp_RC0402.pdf; Author: CERN DEM JLC; CreateDate: 03.12.2007; LatestRevisionDate: 17.10.2012
T_T1 = BSS138LT1G: N-CHANNEL MOSFET WITH DIODE; Part Description: 50V, 200mA N-Channel Enhancement Mode Field-Effect Transistor; Manufacturer: ON SEMICONDUCTOR; PressFit: No; Bonding: No; Part Number: BSS138LT1G; Component Kind: Standard; Component Type: Standard; Device: BSS138LT1G; PackageDescription: SOT23, 0.95mm Pitch; 3 Pin, 1.40mm W X 3.00mm L X 1.10mm H body, IPC Medium Density; Manufacturer Part Number: BSS138L; Pin Count: 3; Case: SOT23-3; Mounted: Yes; Socket: No; SMD: Yes; Sense: No; ComponentHeight: 1.11mm; HelpURL: \\cern.ch\dfs\Applications\Altium\Datasheets\BSS138LT1G.pdf; Author: CERN DEM JLC; CreateDate: 23.03.2009; LatestRevisionDate: 25.05.2022
T_TP1-T_TP10 = SMD_PAD_1.27X1.27MM: Part Description: 1.27mm x 1.27mm PCB Copper Area (SMD Test Point); Mounted: No; Part Number: SMD_PAD_1.27X1.27MM; Component Type: Standard (No BOM); Pin Count: 1; Family: Test Point; Socket: No; SMD: Yes; Sense: No; Status: None; ComponentHeight: 0mm; HelpURL: Undefined; Author: CERN DEM JLC; CreateDate: 12.01.2008; LatestRevisionDate: 12.01.2008; PackageDescription: 1.27mm x 1.27mm PCB Copper Area (SMD Test Point)

## Sheet CPCIS_Connectors_P1_P6.SchDoc: =DocumentName
size A3; SPICEModelCacheRMUUFYQV: <root> / <DocumentId>RMUUFYQV</DocumentId> / </root>; DocumentNumber: 1; Revision: 0; SheetNumber: 7; SheetTotal: 10; Version: 2.0.0; Author 1: Grzegorz Kasprowicz; Author 2: Maciej Przybysz, Marta Fąfara; Author 3: Krzysztof Belewicz; Github: https://github.com/sinara-hw/Grabber; Last modified by: Krzysztof Belewicz
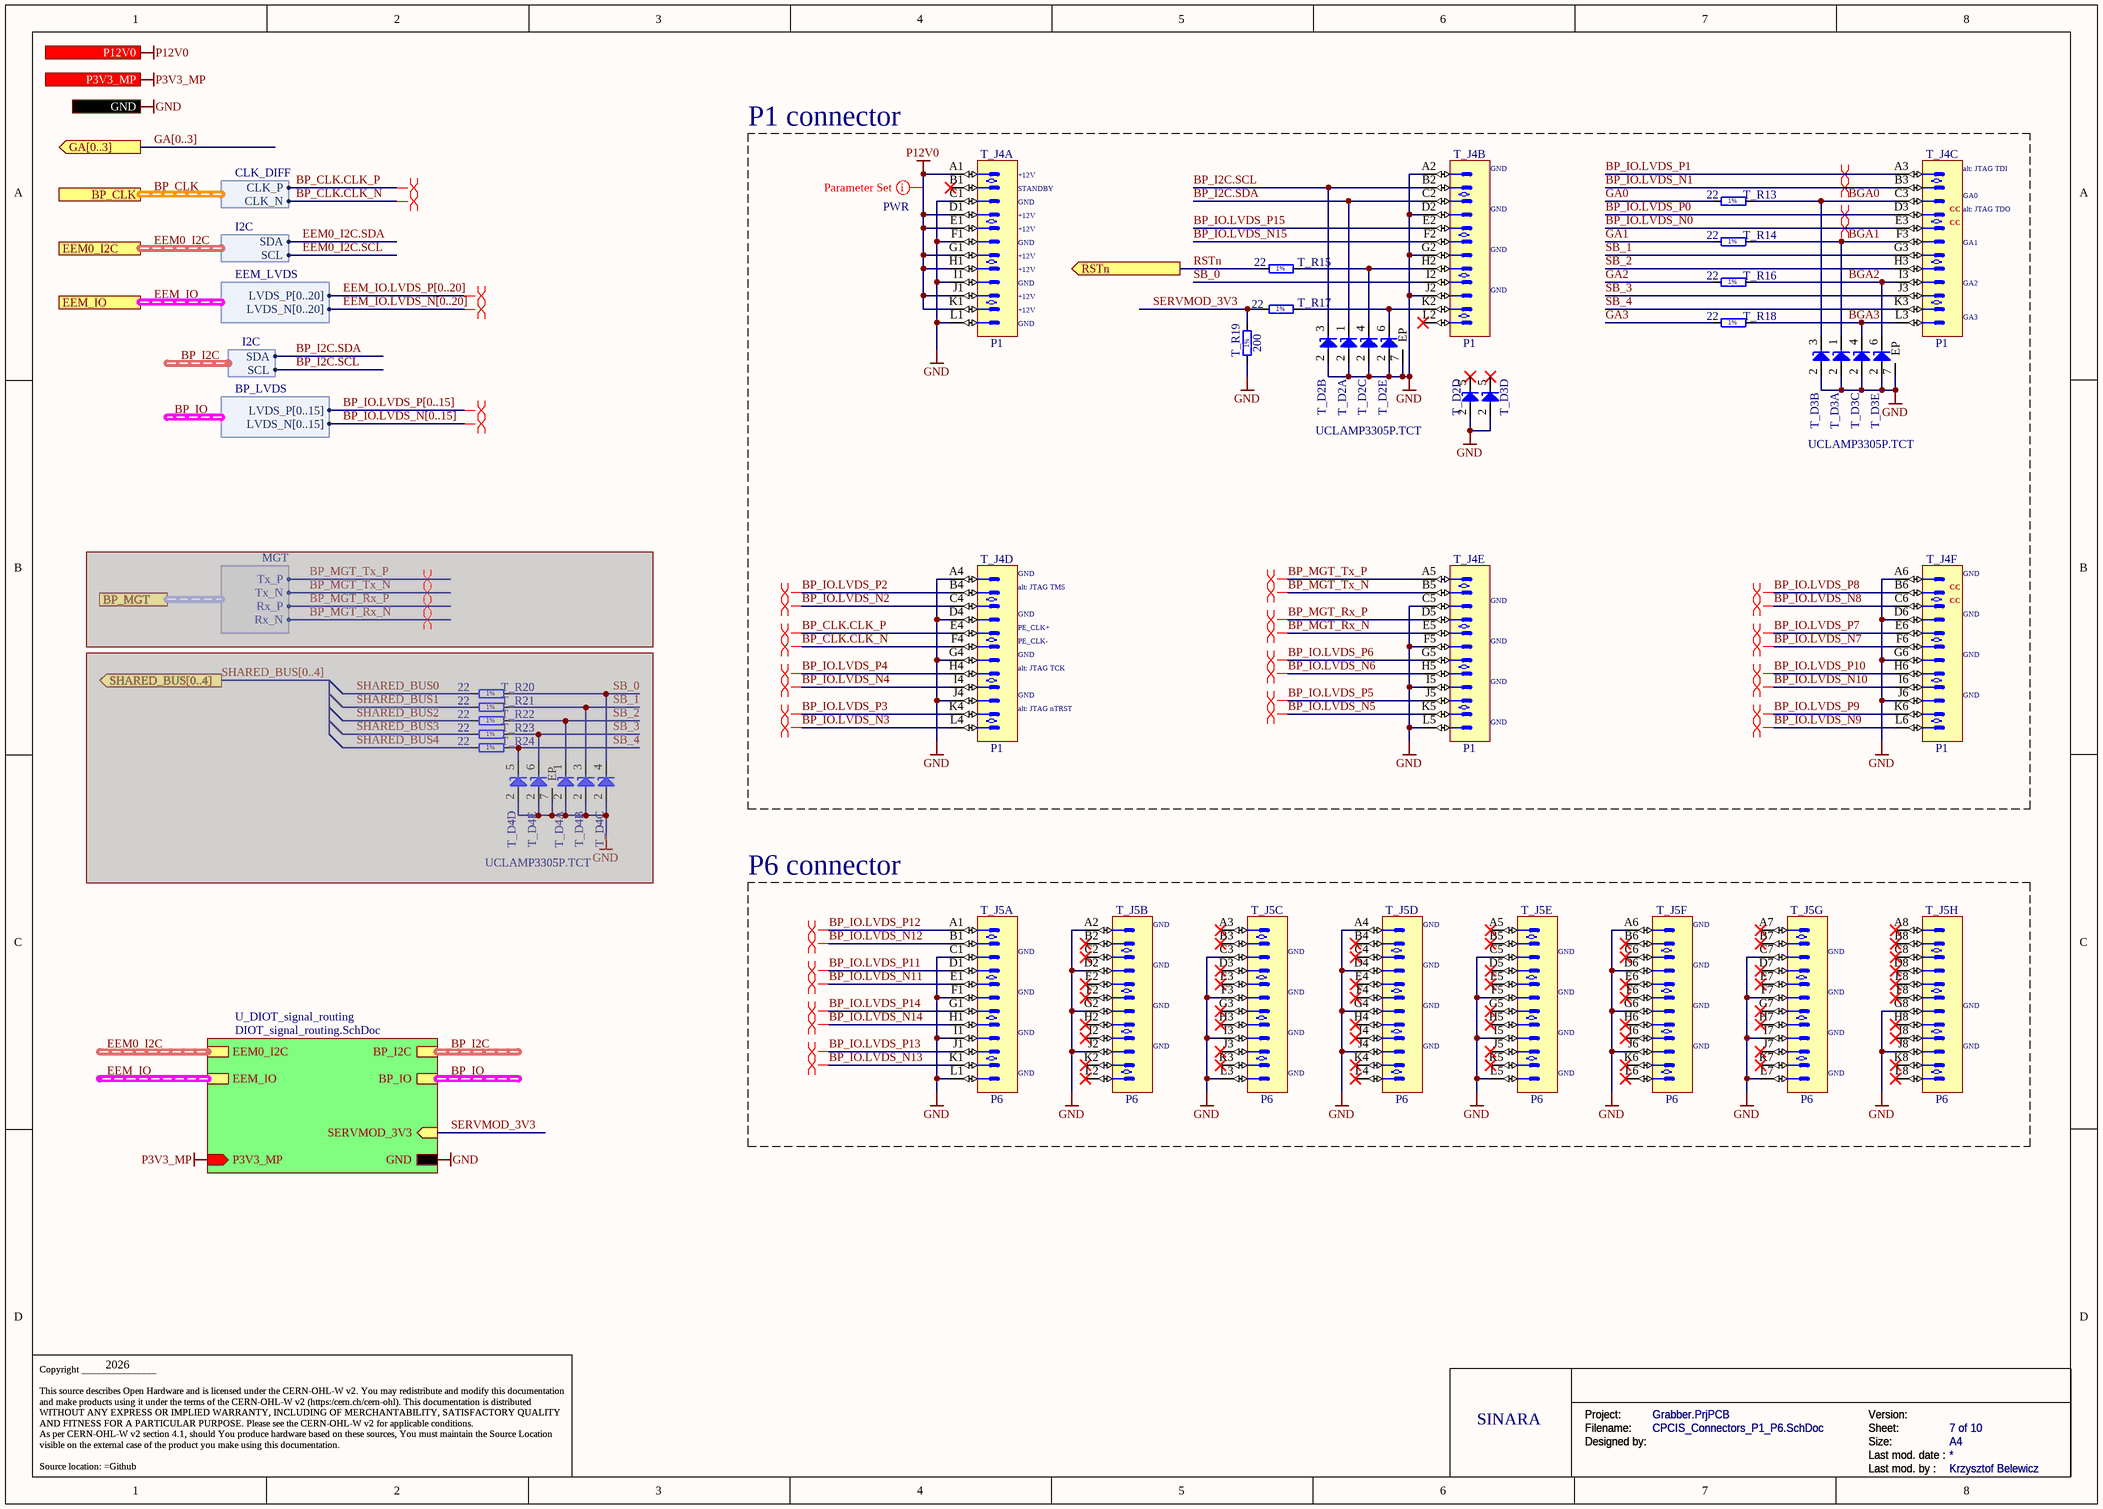
[diagram p2: CPCIS_Connectors_P1_P6.SchDoc]

### Parts
(Parts that share a designator on the sheet are numbered #1, #2 ... from top to bottom, then left to right.)
T_D2  UCLAMP3305P.TCT  [SON50P160X65_HS-7N]  (value not drawn)  (parts A,B,C,D,E of 5)
T_D3  UCLAMP3305P.TCT  [SON50P160X65_HS-7N]  (value not drawn)  (parts A,B,C,D,E of 5)
T_D4#1  UCLAMP3305P.TCT  [SON50P160X65_HS-7N]  (value not drawn)  (parts A,B,C,D,E of 5)  (masked out: inside a compile mask, not in the netlist)
T_J4  P1  [AMPHENOL_10052825-101LF]  (parts A,B,C,D,E,F of 6)
T_J5  P6  [AMPHENOL_10052838-101LF]  (parts A,B,C,D,E,F,G,H of 8)
T_R13  22  [RESC1005X40N]
T_R14  22  [RESC1005X40N]
T_R15  22  [RESC1005X40N]
T_R16  22  [RESC1005X40N]
T_R17  22  [RESC1005X40N]
T_R18  22  [RESC1005X40N]
T_R19  200  [RESC1005X40N]
T_R20  22  [RESC1005X40N]  (masked out: inside a compile mask, not in the netlist)
T_R21  22  [RESC1005X40N]  (masked out: inside a compile mask, not in the netlist)
T_R22  22  [RESC1005X40N]  (masked out: inside a compile mask, not in the netlist)
T_R23  22  [RESC1005X40N]  (masked out: inside a compile mask, not in the netlist)
T_R24  22  [RESC1005X40N]  (masked out: inside a compile mask, not in the netlist)

### Blocks framed on the sheet
P1 connector: T_D2 T_D3 T_J4 T_R13-T_R19
P6 connector: T_J5

### Sub-sheets
U_DIOT_signal_routing = DIOT_signal_routing.SchDoc: BP_I2C (harness I2C), EEM0_I2C (harness I2C), EEM_IO (harness EEM_LVDS), BP_IO (harness BP_LVDS), SERVMOD_3V3 (in), GND, P3V3_MP (in)

### Ports
BP_CLK (harness CLK_DIFF), BP_MGT (harness MGT), EEM0_I2C (harness I2C), EEM_IO (harness EEM_LVDS), GA[0..3] (out), GND, P3V3_MP (in), P12V0 (out), RSTn (out), SHARED_BUS[0..4] (out)

### Harnesses
MGT: Tx_P, Tx_N, Rx_P, Rx_N
CLK_DIFF: CLK_N, CLK_P
I2C: SDA, SCL
EEM_LVDS: LVDS_P[0..20], LVDS_N[0..20]
BP_LVDS: LVDS_N[0..15], LVDS_P[0..15]

### Nets
GND: T_D2.2(A) T_D2.7(EP) T_D3.2(A) T_D3.7(EP) T_J4.A2 T_J4.A4 T_J4.A6 T_J4.C1 T_J4.C5 T_J4.D2 T_J4.D4 T_J4.D6 T_J4.F1 T_J4.F5 T_J4.G2 T_J4.G4 T_J4.G6 T_J4.I1 T_J4.I5 T_J4.J2 T_J4.J4 T_J4.J6 T_J4.L1 T_J4.L5 T_J5.A2 T_J5.A4 T_J5.A6 T_J5.C1 T_J5.C3 T_J5.C5 T_J5.C7 T_J5.D2 T_J5.D4 T_J5.D6 T_J5.F1 T_J5.F3 T_J5.F5 T_J5.F7 T_J5.G2 T_J5.G4 T_J5.G6 T_J5.G8 T_J5.I1 T_J5.I3 T_J5.I5 T_J5.I7 T_J5.J2 T_J5.J4 T_J5.J6 T_J5.J8 T_J5.L1 T_J5.L3 T_J5.L5 T_J5.L7 T_R19.1 ; port GND, sheet U_DIOT_signal_routing/GND
P3V3_MP: port P3V3_MP, sheet U_DIOT_signal_routing/P3V3_MP
P12V0: T_J4.A1 T_J4.D1 T_J4.E1 T_J4.G1 T_J4.H1 T_J4.J1 T_J4.K1 ; port P12V0
BGA0: T_D3.3(C) T_J4.C3 T_R13.2
BGA1: T_D3.1(C) T_J4.F3 T_R14.2
BGA2: T_D3.6(C) T_J4.I3 T_R16.2
BGA3: T_D3.4(C) T_J4.L3 T_R18.2
BP_CLK.CLK_N: T_J4.F4 ; port BP_CLK.CLK_N
BP_CLK.CLK_P: T_J4.E4 ; port BP_CLK.CLK_P
BP_I2C.SCL: T_D2.3(C) T_J4.B2 ; sheet U_DIOT_signal_routing/BP_I2C.SCL
BP_I2C.SDA: T_D2.1(C) T_J4.C2 ; sheet U_DIOT_signal_routing/BP_I2C.SDA
BP_IO.LVDS_N0: T_J4.E3
BP_IO.LVDS_N1: T_J4.B3
BP_IO.LVDS_N2: T_J4.C4
BP_IO.LVDS_N3: T_J4.L4
BP_IO.LVDS_N4: T_J4.I4
BP_IO.LVDS_N5: T_J4.K5
BP_IO.LVDS_N6: T_J4.H5
BP_IO.LVDS_N7: T_J4.F6
BP_IO.LVDS_N8: T_J4.C6
BP_IO.LVDS_N9: T_J4.L6
BP_IO.LVDS_N10: T_J4.I6
BP_IO.LVDS_N11: T_J5.E1
BP_IO.LVDS_N12: T_J5.B1
BP_IO.LVDS_N13: T_J5.K1
BP_IO.LVDS_N14: T_J5.H1
BP_IO.LVDS_N15: T_J4.F2
BP_IO.LVDS_P0: T_J4.D3
BP_IO.LVDS_P1: T_J4.A3
BP_IO.LVDS_P2: T_J4.B4
BP_IO.LVDS_P3: T_J4.K4
BP_IO.LVDS_P4: T_J4.H4
BP_IO.LVDS_P5: T_J4.J5
BP_IO.LVDS_P6: T_J4.G5
BP_IO.LVDS_P7: T_J4.E6
BP_IO.LVDS_P8: T_J4.B6
BP_IO.LVDS_P9: T_J4.K6
BP_IO.LVDS_P10: T_J4.H6
BP_IO.LVDS_P11: T_J5.D1
BP_IO.LVDS_P12: T_J5.A1
BP_IO.LVDS_P13: T_J5.J1
BP_IO.LVDS_P14: T_J5.G1
BP_IO.LVDS_P15: T_J4.E2
BP_MGT_Rx_N: T_J4.E5
BP_MGT_Rx_P: T_J4.D5
BP_MGT_Tx_N: T_J4.B5
BP_MGT_Tx_P: T_J4.A5
GA0: T_R13.1
GA1: T_R14.1
GA2: T_R16.1
GA3: T_R18.1
RSTn: T_R15.1 ; port RSTn
SB_0: T_J4.I2
SB_1: T_J4.G3
SB_2: T_J4.H3
SB_3: T_J4.J3
SB_4: T_J4.K3
SERVMOD_3V3: T_R17.1 T_R19.2 ; sheet U_DIOT_signal_routing/SERVMOD_3V3
NetT_D2_4: T_D2.4(C) T_J4.H2 T_R15.2
NetT_D2_6: T_D2.6(C) T_J4.K2 T_R17.2

Not connected (* = marked no-connect by the designer): T_D2 5(C)*; T_D3 5(C)*; T_J4 B1* L2*; T_J5 A3* A5* A7* A8* B2* B3* B4* B5* B6* B7* B8* C2* C4* C6* C8* D3* D5* D7* D8* E2* E3* E4* E5* E6* E7* E8* F2* F4* F6* F8* G3* G5* G7* H2* H3* H4* H5* H6* H7* H8* I2* I4* I6* I8* J3* J5* J7* K2* K3* K4* K5* K6* K7* K8* L2* L4* L6* L8*

### Buses and harness runs
bus BP_IO.LVDS_N[0..15]
bus BP_IO.LVDS_P[0..15]
bus EEM_IO.LVDS_N[0..20]
bus EEM_IO.LVDS_P[0..20]
bus GA[0..3] = port GA[0..3]
harness BP_CLK = port BP_CLK
harness BP_I2C = sheet U_DIOT_signal_routing/BP_I2C
harness BP_IO = sheet U_DIOT_signal_routing/BP_IO
harness EEM0_I2C = port EEM0_I2C
harness EEM0_I2C = sheet U_DIOT_signal_routing/EEM0_I2C
harness EEM_IO = port EEM_IO
harness EEM_IO = sheet U_DIOT_signal_routing/EEM_IO

### Layout directives
differential pair: (no net found under the mark), BP_IO.LVDS_N0, BP_IO.LVDS_N1, BP_IO.LVDS_N2, BP_IO.LVDS_N3, BP_IO.LVDS_N4, BP_IO.LVDS_N5, BP_IO.LVDS_N6, BP_IO.LVDS_N7, BP_IO.LVDS_N8, BP_IO.LVDS_N9, BP_IO.LVDS_N10, BP_IO.LVDS_N11, BP_IO.LVDS_N12, BP_IO.LVDS_N13, BP_IO.LVDS_N14, BP_IO.LVDS_P0, BP_IO.LVDS_P1, BP_IO.LVDS_P2, BP_IO.LVDS_P3, BP_IO.LVDS_P4, BP_IO.LVDS_P5, BP_IO.LVDS_P6, BP_IO.LVDS_P7, BP_IO.LVDS_P8, BP_IO.LVDS_P9, BP_IO.LVDS_P10, BP_IO.LVDS_P11, BP_IO.LVDS_P12, BP_IO.LVDS_P13, BP_IO.LVDS_P14
differential pair; differential pair class Diff_100Ohm: (no net found under the mark), BP_CLK.CLK_N, BP_CLK.CLK_P
differential pair; differential pair class MGT: (no net found under the mark), BP_MGT_Rx_N, BP_MGT_Rx_P, BP_MGT_Tx_N, BP_MGT_Tx_P
net class PWR: P12V0

### Notes on the sheet
- (near T_J4) +12V
- (near T_J4) GND
- (near T_J4) alt: JTAG TDI
- (near T_J4) STANDBY
- (near T_J4) CC
- (near T_J4) alt: JTAG TDO
- (near T_J4) GA1
- (near T_J4) GA0
- (near T_J4) GA2
- (near T_J4) GA3
- (near T_J4) alt: JTAG TMS
- (near T_J4) PE_CLK+
- (near T_J4) PE_CLK-
- (near T_J4) alt: JTAG TCK
- (near T_J4) alt: JTAG nTRST
- (near T_J5) GND
- 2026
- SINARA
- Project:
- Designed by:
- Filename:
- Size:
- Version:
- Last mod. date :
- Sheet:
- A4
- Copyright _______________
  This source describes Open Hardware and is licensed under the CERN-OHL-W v2. You may redistribute and modify this documentation and make products using it under the terms of the CERN-OHL-W v2 (https:/cern.ch/cern-ohl). This documentation is distributed WITHOUT ANY EXPRESS OR IMPLIED WARRANTY, INCLUDING OF MERCHANTABILITY, SATISFACTORY QUALITY AND FITNESS FOR A PARTICULAR PURPOSE. Please see the CERN-OHL-W v2 for applicable conditions.
  As per CERN-OHL-W v2 section 4.1, should You produce hardware based on these sources, You must maintain the Source Location visible on the external case of the product you make using this documentation.
  Source location: =Github
- Last mod. by :
- (in symbol R0402_22R_1%_0.0625W_100PPM) 1%
- (in symbol R0402_200R_1%_0.0625W_100PPM) 1%

### Library data of the parts
T_D2 T_D3 T_D4#1 = CMP-004-00037-2: Diode TVS Quint Common Anode Uni-Dir 3.3V 40W 6-Pin SLP EP T/R; Max Operating Temperature: 125°C; Min Operating Temperature: -55°C; Pins: 6; Mounting Technology: Surface Mount
T_J4 = AMPHENOL_10052825-101LF: 72 Contacts Header, 6 Columns, 4 Pairs per Column; Part Description: 72 Contacts, 2mm Pitch, 6 Columns, 4 Pairs per Column, 4 Walls, Right Angle Header; Part Number: AMPHENOL_10052825-101LF; Component Kind: Standard; Component Type: Standard; Pin Count: 72; Family: AirMax VS; Mounted: Yes; Socket: No; SMD: No; PressFit: Yes; Sense: No; Status: None; Manufacturer: AMPHENOL; Manufacturer Part Number: 10052825-101LF; ComponentHeight: 15.35mm; HelpURL: \\cern.ch\dfs\Applications\Altium\Datasheets\AMPHENOL_10052825-101LF.pdf; ComponentLink1URL: \\cern.ch\dfs\Applications\Altium\Datasheets\AMPHENOL_10052825-101LF_Application.pdf; ComponentLink1Description: Application; Author: CERN DEM MR; CreateDate: 19/02/2018; LatestRevisionDate: 19/02/2018; Classname: Overlapping
T_J5 = AMPHENOL_10052838-101LF: 96 Contacts Header, 8 Columns, 4 Pairs per Column; Part Description: 96 Contacts, 2mm Pitch, 8 Columns, 4 Pairs per Column, 4 Walls, Right Angle Header; Part Number: AMPHENOL_10052838-101LF; Component Kind: Standard; Component Type: Standard; Pin Count: 96; Family: AirMax VS; Mounted: Yes; Socket: No; SMD: No; PressFit: Yes; Sense: No; Status: None; Manufacturer: AMPHENOL; Manufacturer Part Number: 10052838-101LF; ComponentHeight: 15.35mm; HelpURL: \\cern.ch\dfs\Applications\Altium\Datasheets\AMPHENOL_10052838-101LF.pdf; ComponentLink1URL: \\cern.ch\dfs\Applications\Altium\Datasheets\AMPHENOL_10052838-101LF_Application.pdf; ComponentLink1Description: Application; Author: CERN DEM MR; CreateDate: 19.02.2018; LatestRevisionDate: 19.02.2018
T_R13-T_R18 T_R20-T_R24 = R0402_22R_1%_0.0625W_100PPM: Resistor - 1%; Part Description: General Purpose Thick Film Chip Resistor; Manufacturer: GENERIC; Manufacturer1 Part Number: 232270672209L; PressFit: No; Part Number: R0402_22R_1%_0.0625W_100PPM; Component Kind: Standard; Component Type: Standard; Pin Count: 2; Value: 22; Status: Not Recommended; Power: 0.0625W; Tolerance: ±1%; Manufacturer Part Number: R0402_22R_1%_0.0625W_100PPM; Case: 0402; Mounted: Yes; Socket: No; SMD: Yes; Manufacturer1 Example: YAGEO PHYCOMP; Manufacturer1 ComponentHeight: 0.4mm; HelpURL: \\cern.ch\dfs\Applications\Altium\Datasheets\R0402_Phycomp_RC0402.pdf; Author: CERN DEM JLC; CreateDate: 03.12.2007; LatestRevisionDate: 17.10.2012; Sense: No
T_R19 = R0402_200R_1%_0.0625W_100PPM: Resistor - 1%; Part Description: General Purpose Thick Film Chip Resistor; Manufacturer: GENERIC; Manufacturer1 Part Number: 232270672001L; TC: ±100ppm/°C; PressFit: No; Part Number: R0402_200R_1%_0.0625W_100PPM; Component Kind: Standard; Component Type: Standard; Pin Count: 2; Value: 200; Status: Not Recommended; Power: 0.0625W; Tolerance: ±1%; Manufacturer Part Number: R0402_200R_1%_0.0625W_100PPM; Case: 0402; Mounted: Yes; Sense: No; Socket: No; SMD: Yes; Manufacturer1 Example: YAGEO PHYCOMP; Manufacturer1 ComponentHeight: 0.4mm; HelpURL: \\cern.ch\dfs\Applications\Altium\Datasheets\R0402_Phycomp_RC0402.pdf; Author: CERN DEM JLC; CreateDate: 2007-12-03; LatestRevisionDate: 2012-10-17

## Sheet DIOT_signal_routing.SchDoc: =DocumentName
size A4; DocumentNumber: 1; Revision: 0; SheetNumber: 8; SheetTotal: 10; Version: 2.0.0; Author 1: Grzegorz Kasprowicz; Author 2: Maciej Przybysz, Marta Fąfara; Author 3: Krzysztof Belewicz; Github: https://github.com/sinara-hw/Grabber; Last modified by: Krzysztof Belewicz
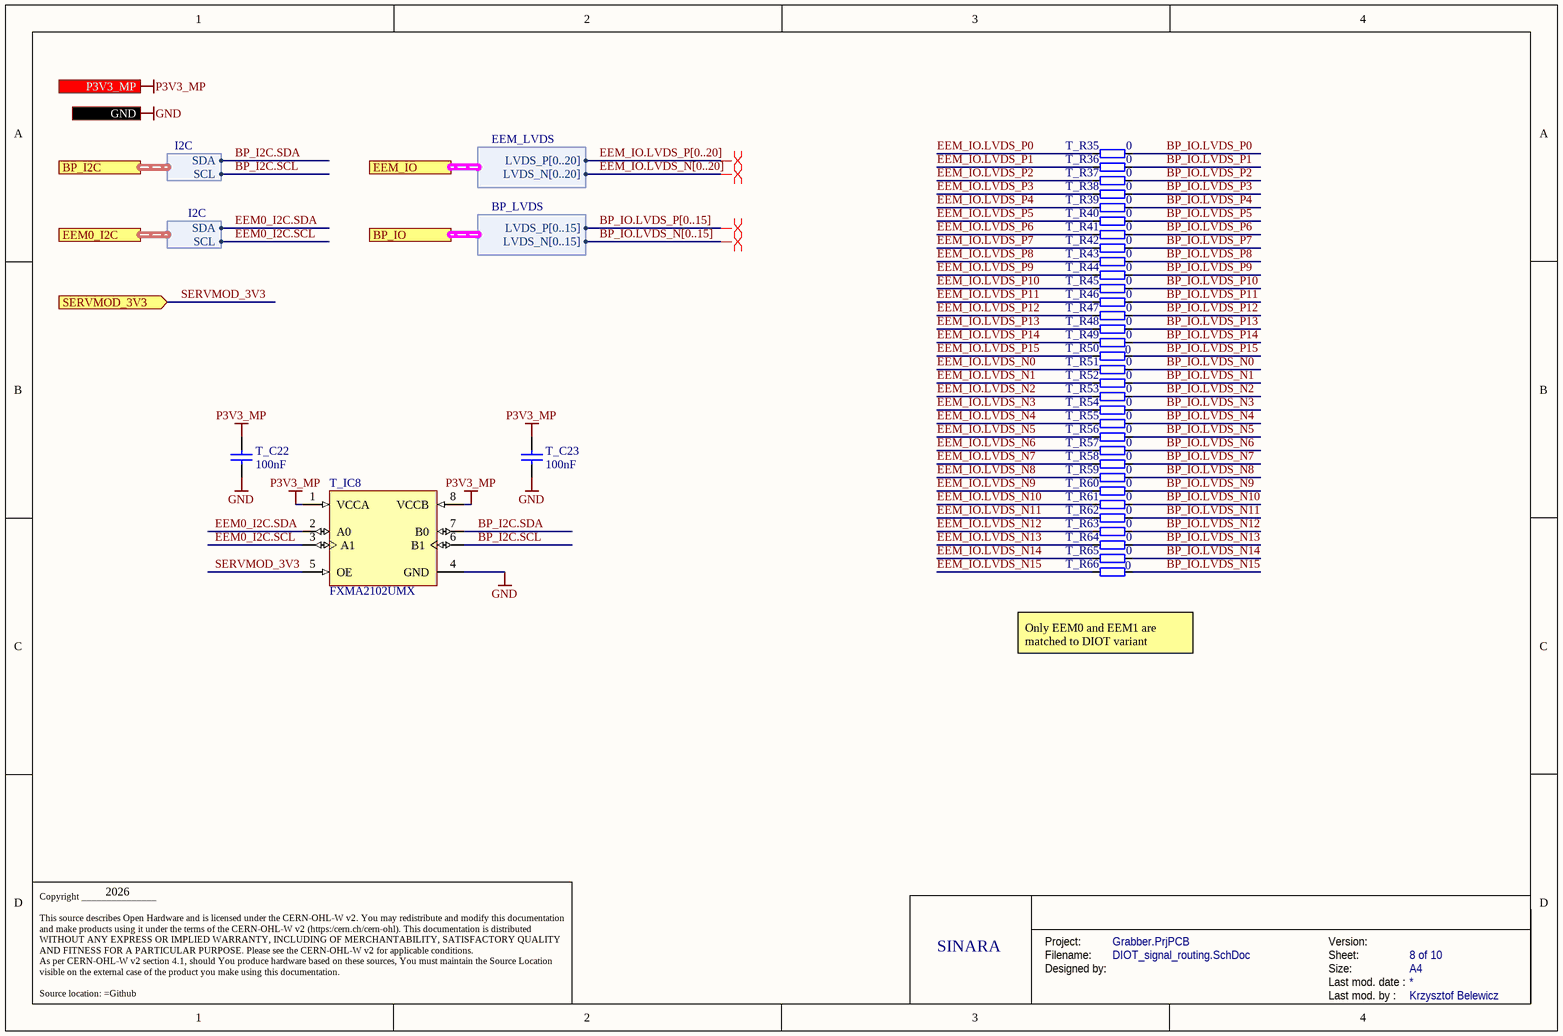
[diagram p3: DIOT_signal_routing.SchDoc]

### Parts
T_C22  100nF  [CAPC1005X55N]
T_C23  100nF  [CAPC1005X55N]
T_IC8  FXMA2102UMX  [FXMA2102UMX]
T_R35  0  [RESC1005X40N]
T_R36  0  [RESC1005X40N]
T_R37  0  [RESC1005X40N]
T_R38  0  [RESC1005X40N]
T_R39  0  [RESC1005X40N]
T_R40  0  [RESC1005X40N]
T_R41  0  [RESC1005X40N]
T_R42  0  [RESC1005X40N]
T_R43  0  [RESC1005X40N]
T_R44  0  [RESC1005X40N]
T_R45  0  [RESC1005X40N]
T_R46  0  [RESC1005X40N]
T_R47  0  [RESC1005X40N]
T_R48  0  [RESC1005X40N]
T_R49  0  [RESC1005X40N]
T_R50  0  [RESC1005X40N]
T_R51  0  [RESC1005X40N]
T_R52  0  [RESC1005X40N]
T_R53  0  [RESC1005X40N]
T_R54  0  [RESC1005X40N]
T_R55  0  [RESC1005X40N]
T_R56  0  [RESC1005X40N]
T_R57  0  [RESC1005X40N]
T_R58  0  [RESC1005X40N]
T_R59  0  [RESC1005X40N]
T_R60  0  [RESC1005X40N]
T_R61  0  [RESC1005X40N]
T_R62  0  [RESC1005X40N]
T_R63  0  [RESC1005X40N]
T_R64  0  [RESC1005X40N]
T_R65  0  [RESC1005X40N]
T_R66  0  [RESC1005X40N]

### Ports
BP_I2C (harness I2C), BP_IO (harness BP_LVDS), EEM0_I2C (harness I2C), EEM_IO (harness EEM_LVDS), GND, P3V3_MP (in), SERVMOD_3V3 (in)

### Harnesses
I2C: SDA, SCL
EEM_LVDS: LVDS_P[0..20], LVDS_N[0..20]
BP_LVDS: LVDS_P[0..15], LVDS_N[0..15]

### Nets
GND: T_C22.1 T_C23.1 T_IC8.4(GND) ; port GND
P3V3_MP: T_C22.2 T_C23.2 T_IC8.1(VCCA) T_IC8.8(VCCB) ; port P3V3_MP
BP_I2C.SCL: T_IC8.6(B1) ; port BP_I2C.SCL
BP_I2C.SDA: T_IC8.7(B0) ; port BP_I2C.SDA
BP_IO.LVDS_N0: T_R51.1
BP_IO.LVDS_N1: T_R52.1
BP_IO.LVDS_N2: T_R53.1
BP_IO.LVDS_N3: T_R54.1
BP_IO.LVDS_N4: T_R55.1
BP_IO.LVDS_N5: T_R56.1
BP_IO.LVDS_N6: T_R57.1
BP_IO.LVDS_N7: T_R58.1
BP_IO.LVDS_N8: T_R59.1
BP_IO.LVDS_N9: T_R60.1
BP_IO.LVDS_N10: T_R61.1
BP_IO.LVDS_N11: T_R62.1
BP_IO.LVDS_N12: T_R63.1
BP_IO.LVDS_N13: T_R64.1
BP_IO.LVDS_N14: T_R65.1
BP_IO.LVDS_N15: T_R66.2
BP_IO.LVDS_P0: T_R35.1
BP_IO.LVDS_P1: T_R36.1
BP_IO.LVDS_P2: T_R37.1
BP_IO.LVDS_P3: T_R38.1
BP_IO.LVDS_P4: T_R39.1
BP_IO.LVDS_P5: T_R40.1
BP_IO.LVDS_P6: T_R41.1
BP_IO.LVDS_P7: T_R42.1
BP_IO.LVDS_P8: T_R43.1
BP_IO.LVDS_P9: T_R44.1
BP_IO.LVDS_P10: T_R45.1
BP_IO.LVDS_P11: T_R46.1
BP_IO.LVDS_P12: T_R47.1
BP_IO.LVDS_P13: T_R48.1
BP_IO.LVDS_P14: T_R49.1
BP_IO.LVDS_P15: T_R50.2
EEM0_I2C.SCL: T_IC8.3(A1) ; port EEM0_I2C.SCL
EEM0_I2C.SDA: T_IC8.2(A0) ; port EEM0_I2C.SDA
EEM_IO.LVDS_N0: T_R51.2
EEM_IO.LVDS_N1: T_R52.2
EEM_IO.LVDS_N2: T_R53.2
EEM_IO.LVDS_N3: T_R54.2
EEM_IO.LVDS_N4: T_R55.2
EEM_IO.LVDS_N5: T_R56.2
EEM_IO.LVDS_N6: T_R57.2
EEM_IO.LVDS_N7: T_R58.2
EEM_IO.LVDS_N8: T_R59.2
EEM_IO.LVDS_N9: T_R60.2
EEM_IO.LVDS_N10: T_R61.2
EEM_IO.LVDS_N11: T_R62.2
EEM_IO.LVDS_N12: T_R63.2
EEM_IO.LVDS_N13: T_R64.2
EEM_IO.LVDS_N14: T_R65.2
EEM_IO.LVDS_N15: T_R66.1
EEM_IO.LVDS_P0: T_R35.2
EEM_IO.LVDS_P1: T_R36.2
EEM_IO.LVDS_P2: T_R37.2
EEM_IO.LVDS_P3: T_R38.2
EEM_IO.LVDS_P4: T_R39.2
EEM_IO.LVDS_P5: T_R40.2
EEM_IO.LVDS_P6: T_R41.2
EEM_IO.LVDS_P7: T_R42.2
EEM_IO.LVDS_P8: T_R43.2
EEM_IO.LVDS_P9: T_R44.2
EEM_IO.LVDS_P10: T_R45.2
EEM_IO.LVDS_P11: T_R46.2
EEM_IO.LVDS_P12: T_R47.2
EEM_IO.LVDS_P13: T_R48.2
EEM_IO.LVDS_P14: T_R49.2
EEM_IO.LVDS_P15: T_R50.1
SERVMOD_3V3: T_IC8.5(OE) ; port SERVMOD_3V3

### Buses and harness runs
bus BP_IO.LVDS_N[0..15]
bus BP_IO.LVDS_P[0..15]
bus EEM_IO.LVDS_N[0..20]
bus EEM_IO.LVDS_P[0..20]

### Layout directives
differential pair; differential pair class Diff_100Ohm: (no net found under the mark)
differential pair: (no net found under the mark)

### Notes on the sheet
- Only EEM0 and EEM1 are matched to DIOT variant
- 2026
- SINARA
- Project:
- Designed by:
- Filename:
- Size:
- Version:
- Last mod. date :
- Sheet:
- A4
- Copyright _______________
  This source describes Open Hardware and is licensed under the CERN-OHL-W v2. You may redistribute and modify this documentation and make products using it under the terms of the CERN-OHL-W v2 (https:/cern.ch/cern-ohl). This documentation is distributed WITHOUT ANY EXPRESS OR IMPLIED WARRANTY, INCLUDING OF MERCHANTABILITY, SATISFACTORY QUALITY AND FITNESS FOR A PARTICULAR PURPOSE. Please see the CERN-OHL-W v2 for applicable conditions.
  As per CERN-OHL-W v2 section 4.1, should You produce hardware based on these sources, You must maintain the Source Location visible on the external case of the product you make using this documentation.
  Source location: =Github
- Last mod. by :

### Library data of the parts
T_C22 T_C23 = CC0402_100NF_50V_10%_X7R: as C59 on sheet Power_Supplies; Part Number: CC0402_100NF_50V_10%_X7R; Component Kind: Standard; Component Type: Standard; Pin Count: 2; Value: 100nF; Status: None; Manufacturer Part Number: CC0402_100NF_50V_10%_X7R; Case: 0402; Mounted: Yes; Socket: No; SMD: Yes; Sense: No; HelpURL: \\cern.ch\dfs\Applications\Altium\Datasheets\CC0402_MURATA_GRM155R71H104KE14D.pdf; Author: CERN DEM MR; CreateDate: 30.06.2017; LatestRevisionDate: 30.06.2017; Manufacturer1 Example: MURATA; Manufacturer1 ComponentHeight: 0.55mm
T_IC8 = CMP-015-00014-1: Dual Supply 2-Bit Voltage Translator/Buffer/Repeater Isolator for I2C Applications; Manufacturer: Onsemi; Max Supply Voltage: 5.5V; Min Supply Voltage: 1.65V; Min Operating Temperature: -40°C; Pins: 8; Max Operating Temperature: 85°C; Manufacaturer Part Number: FXMA2102UMX; Mounting Technology: Surface Mount
T_R35-T_R66 = R0402_0R_JUMPER: as T_R2 on sheet Power_Supplies; Part Number: R0402_0R_JUMPER; Component Kind: Standard; Component Type: Standard; Pin Count: 2; Value: 0; Status: Not Recommended; Manufacturer Part Number: R0402_0R_JUMPER; Case: 0402; Mounted: Yes; Sense: No; Socket: No; SMD: Yes; Manufacturer1 Example: YAGEO PHYCOMP; Manufacturer1 ComponentHeight: 0.4mm; HelpURL: \\cern.ch\dfs\Applications\Altium\Datasheets\R0402_Phycomp_RC0402.pdf; Author: CERN DEM JLC; CreateDate: 03.12.2007; LatestRevisionDate: 17.10.2012